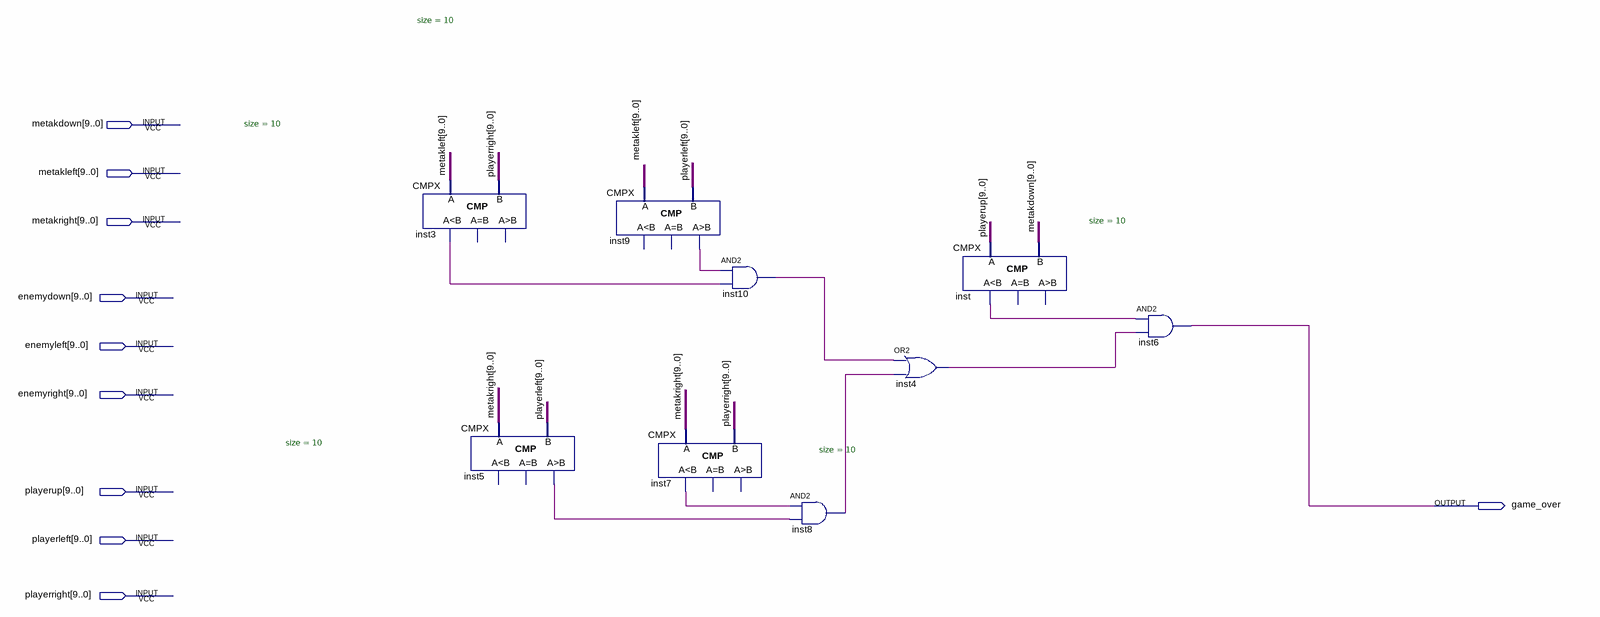
[diagram p0: schematic sheet]
// Quartus schematic game_over_collision.bdf as structural Verilog: 9 symbols, 10 pins
module game_over_collision (
  input  [9:0] metakdown,
  input  [9:0] metakleft,
  input  [9:0] metakright,
  input  [9:0] enemydown,
  input  [9:0] enemyleft,
  input  [9:0] enemyright,
  input  [9:0] playerup,
  input  [9:0] playerleft,
  input  [9:0] playerright,
  output game_over
);

  wire inst3_ls, inst4_out, inst5_gr, inst7_ls, inst8_out, inst9_gr, inst10_out, inst_ls;

  CMPX #(.size(10)) inst3 (.A(metakleft), .B(playerright), .ls(inst3_ls));  // open: eq, gr
  CMPX #(.size(10)) inst5 (.A(metakright), .B(playerleft), .gr(inst5_gr));  // open: ls, eq
  CMPX #(.size(10)) inst9 (.A(metakleft), .B(playerleft), .gr(inst9_gr));  // open: ls, eq
  CMPX #(.size(10)) inst7 (.A(metakright), .B(playerright), .ls(inst7_ls));  // open: eq, gr
  and inst10 (inst10_out, inst9_gr, inst3_ls);
  and inst8 (inst8_out, inst7_ls, inst5_gr);
  or inst4 (inst4_out, inst10_out, inst8_out);
  CMPX #(.size(10)) inst (.A(playerup), .B(metakdown), .ls(inst_ls));  // open: eq, gr
  and inst6 (game_over, inst_ls, inst4_out);
endmodule
